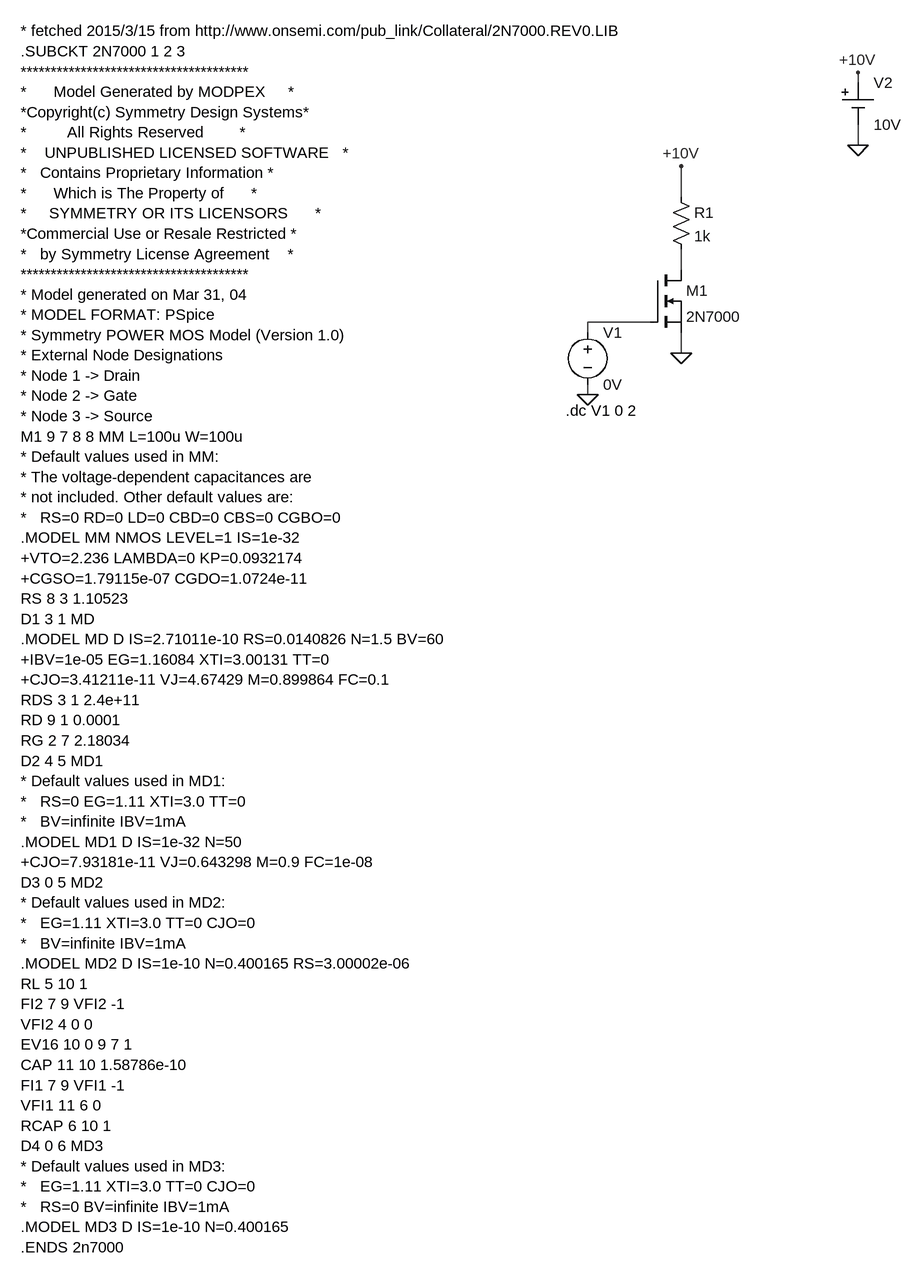
[diagram p0: schematic Lab 1 MOSFET imported as subckt.asc]
Lab 1 MOSFET imported as subckt.asc, the LTspice schematic file:
Version 4
SHEET 1 880 1440
WIRE 496 -176 496 -192
WIRE 496 -80 496 -112
WIRE 224 0 224 -48
WIRE 224 112 224 80
WIRE 176 192 80 192
WIRE 80 208 80 192
WIRE 224 240 224 208
WIRE 80 304 80 288
FLAG 80 304 0
FLAG 224 240 0
FLAG 496 -80 0
FLAG 496 -192 +10V
FLAG 224 -48 +10V
SYMBOL nmos 176 112 R0
SYMATTR InstName M1
SYMATTR Value 2N7000
SYMATTR Prefix X
SYMBOL voltage 80 192 R0
WINDOW 123 0 0 Left 0
WINDOW 39 0 0 Left 0
SYMATTR InstName V1
SYMATTR Value 0V
SYMBOL res 208 -16 R0
SYMATTR InstName R1
SYMATTR Value 1k
SYMBOL Misc\\cell 496 -176 R0
WINDOW 123 0 0 Left 0
WINDOW 39 0 0 Left 0
SYMATTR InstName V2
SYMATTR Value 10V
TEXT 46 328 Left 2 !.dc V1 0 2
TEXT -792 -256 Left 2 !* fetched 2015/3/15 from http://www.onsemi.com/pub_link/Collateral/2N7000.REV0.LIB\n.SUBCKT 2N7000 1 2 3\n**************************************\n*      Model Generated by MODPEX     *\n*Copyright(c) Symmetry Design Systems*\n*         All Rights Reserved        *\n*    UNPUBLISHED LICENSED SOFTWARE   *\n*   Contains Proprietary Information *\n*      Which is The Property of      *\n*     SYMMETRY OR ITS LICENSORS      *\n*Commercial Use or Resale Restricted *\n*   by Symmetry License Agreement    *\n**************************************\n* Model generated on Mar 31, 04\n* MODEL FORMAT: PSpice\n* Symmetry POWER MOS Model (Version 1.0)\n* External Node Designations\n* Node 1 -> Drain\n* Node 2 -> Gate\n* Node 3 -> Source\nM1 9 7 8 8 MM L=100u W=100u\n* Default values used in MM:\n* The voltage-dependent capacitances are\n* not included. Other default values are:\n*   RS=0 RD=0 LD=0 CBD=0 CBS=0 CGBO=0\n.MODEL MM NMOS LEVEL=1 IS=1e-32\n+VTO=2.236 LAMBDA=0 KP=0.0932174\n+CGSO=1.79115e-07 CGDO=1.0724e-11\nRS 8 3 1.10523\nD1 3 1 MD\n.MODEL MD D IS=2.71011e-10 RS=0.0140826 N=1.5 BV=60\n+IBV=1e-05 EG=1.16084 XTI=3.00131 TT=0\n+CJO=3.41211e-11 VJ=4.67429 M=0.899864 FC=0.1\nRDS 3 1 2.4e+11\nRD 9 1 0.0001\nRG 2 7 2.18034\nD2 4 5 MD1\n* Default values used in MD1:\n*   RS=0 EG=1.11 XTI=3.0 TT=0\n*   BV=infinite IBV=1mA\n.MODEL MD1 D IS=1e-32 N=50\n+CJO=7.93181e-11 VJ=0.643298 M=0.9 FC=1e-08\nD3 0 5 MD2\n* Default values used in MD2:\n*   EG=1.11 XTI=3.0 TT=0 CJO=0\n*   BV=infinite IBV=1mA\n.MODEL MD2 D IS=1e-10 N=0.400165 RS=3.00002e-06\nRL 5 10 1\nFI2 7 9 VFI2 -1\nVFI2 4 0 0\nEV16 10 0 9 7 1\nCAP 11 10 1.58786e-10\nFI1 7 9 VFI1 -1\nVFI1 11 6 0\nRCAP 6 10 1\nD4 0 6 MD3\n* Default values used in MD3:\n*   EG=1.11 XTI=3.0 TT=0 CJO=0\n*   RS=0 BV=infinite IBV=1mA\n.MODEL MD3 D IS=1e-10 N=0.400165\n.ENDS 2n7000

The netlist it stands for:
* Lab 1 MOSFET imported as subckt.asc
XM1 N001 N002 0 2N7000  ; pins D G S
V1 N002 0 0V
R1 +10V N001 1k
V2 +10V 0 10V
.dc V1 0 2
* fetched 2015/3/15 from http://www.onsemi.com/pub_link/Collateral/2N7000.REV0.LIB
.SUBCKT 2N7000 1 2 3
**************************************
*      Model Generated by MODPEX     *
*Copyright(c) Symmetry Design Systems*
*         All Rights Reserved        *
*    UNPUBLISHED LICENSED SOFTWARE   *
*   Contains Proprietary Information *
*      Which is The Property of      *
*     SYMMETRY OR ITS LICENSORS      *
*Commercial Use or Resale Restricted *
*   by Symmetry License Agreement    *
**************************************
* Model generated on Mar 31, 04
* MODEL FORMAT: PSpice
* Symmetry POWER MOS Model (Version 1.0)
* External Node Designations
* Node 1 -> Drain
* Node 2 -> Gate
* Node 3 -> Source
M1 9 7 8 8 MM L=100u W=100u
* Default values used in MM:
* The voltage-dependent capacitances are
* not included. Other default values are:
*   RS=0 RD=0 LD=0 CBD=0 CBS=0 CGBO=0
.MODEL MM NMOS LEVEL=1 IS=1e-32
+VTO=2.236 LAMBDA=0 KP=0.0932174
+CGSO=1.79115e-07 CGDO=1.0724e-11
RS 8 3 1.10523
D1 3 1 MD
.MODEL MD D IS=2.71011e-10 RS=0.0140826 N=1.5 BV=60
+IBV=1e-05 EG=1.16084 XTI=3.00131 TT=0
+CJO=3.41211e-11 VJ=4.67429 M=0.899864 FC=0.1
RDS 3 1 2.4e+11
RD 9 1 0.0001
RG 2 7 2.18034
D2 4 5 MD1
* Default values used in MD1:
*   RS=0 EG=1.11 XTI=3.0 TT=0
*   BV=infinite IBV=1mA
.MODEL MD1 D IS=1e-32 N=50
+CJO=7.93181e-11 VJ=0.643298 M=0.9 FC=1e-08
D3 0 5 MD2
* Default values used in MD2:
*   EG=1.11 XTI=3.0 TT=0 CJO=0
*   BV=infinite IBV=1mA
.MODEL MD2 D IS=1e-10 N=0.400165 RS=3.00002e-06
RL 5 10 1
FI2 7 9 VFI2 -1
VFI2 4 0 0
EV16 10 0 9 7 1
CAP 11 10 1.58786e-10
FI1 7 9 VFI1 -1
VFI1 11 6 0
RCAP 6 10 1
D4 0 6 MD3
* Default values used in MD3:
*   EG=1.11 XTI=3.0 TT=0 CJO=0
*   RS=0 BV=infinite IBV=1mA
.MODEL MD3 D IS=1e-10 N=0.400165
.ENDS 2n7000
.backanno
.end